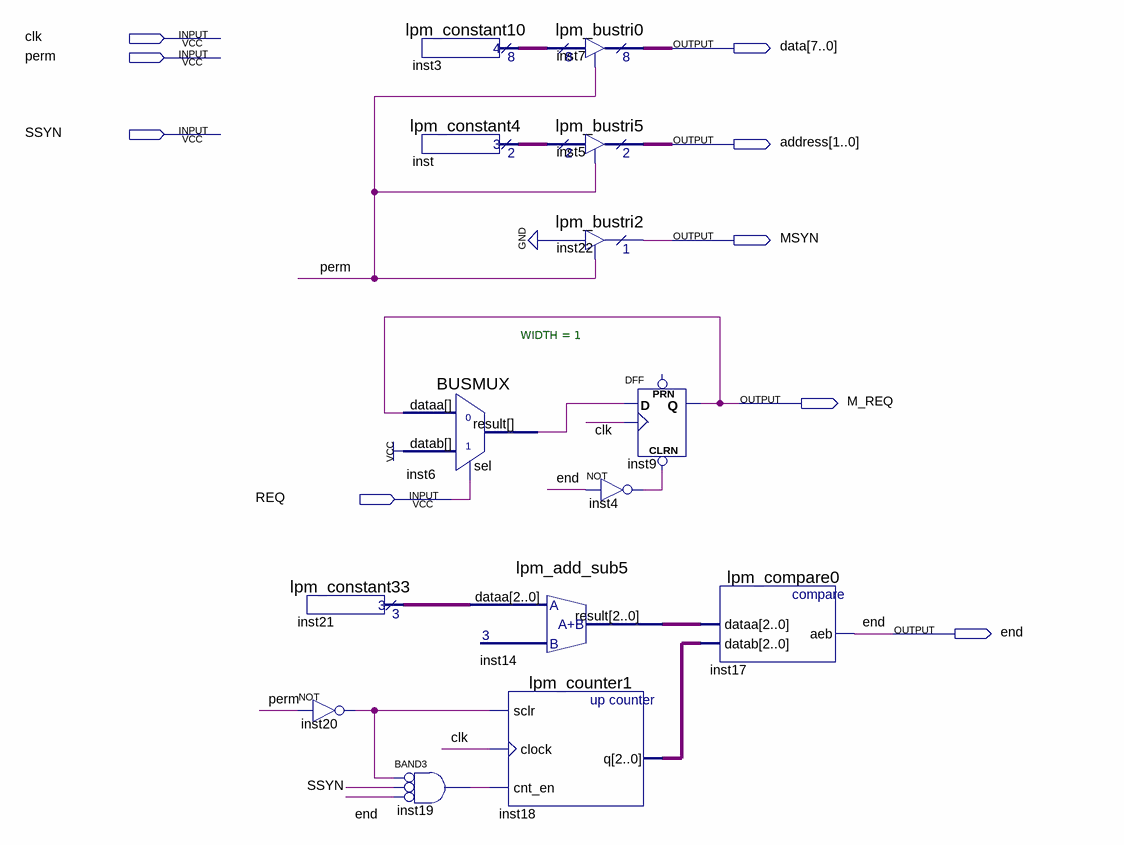
[diagram p0: schematic sheet]
// Quartus schematic Master4.bdf as structural Verilog: 14 symbols, 9 pins
module Master4 (
  input  clk,
  input  perm,
  input  SSYN,
  input  REQ,
  output [7:0] data,
  output [1:0] address,
  output MSYN,
  output M_REQ,
  output \end 
);

  wire inst4_out, inst6_result, inst19_out, inst20_out;
  wire [1:0] inst_result;
  wire [2:0] inst14_result, inst18_q, inst21_result;
  wire [7:0] inst3_result;

  lpm_constant33 inst21 (.result(inst21_result));
  not inst20 (inst20_out, perm);
  lpm_constant10 inst3 (.result(inst3_result));
  lpm_constant4 inst (.result(inst_result));
  BUSMUX #(.WIDTH(1)) inst6 (.datab(1'b1), .sel(REQ), .dataa(M_REQ), .result(inst6_result));
  and inst19 (inst19_out, ~inst20_out, ~SSYN, ~\end );  // BAND3
  lpm_add_sub5 inst14 (.dataa(inst21_result), .result(inst14_result));
  lpm_bustri0 inst7 (.enabledt(perm), .data(inst3_result), .tridata(data));
  lpm_bustri5 inst5 (.enabledt(perm), .data(inst_result), .tridata(address));
  lpm_bustri2 inst22 (.enabledt(perm), .data(1'b0), .tridata(MSYN));
  lpm_counter1 inst18 (.sclr(inst20_out), .clock(clk), .cnt_en(inst19_out), .q(inst18_q));
  DFF inst9 (.CLRN(inst4_out), .CLK(clk), .D(inst6_result), .Q(M_REQ));  // open: PRN
  not inst4 (inst4_out, \end );
  lpm_compare0 inst17 (.dataa(inst14_result), .datab(inst18_q), .aeb(\end ));
endmodule
